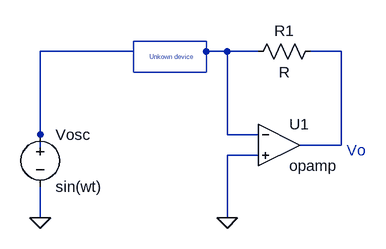
[diagram p0: schematic Draft1.asc]
Draft1.asc, the LTspice schematic file:
Version 4
SHEET 1 880 680
WIRE 336 208 192 208
WIRE 448 208 448 192
WIRE 480 208 448 208
WIRE 528 208 480 208
WIRE 656 208 608 208
WIRE 448 240 448 208
WIRE 192 336 192 208
WIRE 480 336 480 208
WIRE 528 336 480 336
WIRE 656 352 656 208
WIRE 656 352 592 352
WIRE 192 368 192 336
WIRE 528 368 480 368
WIRE 192 464 192 416
WIRE 480 464 480 368
FLAG 480 464 0
FLAG 192 464 0
SYMBOL voltage 192 320 R0
WINDOW 0 50 16 Center 2
SYMATTR InstName Vosc
SYMATTR Value sin(wt)
SYMBOL Opamps/opamp 560 288 R0
SYMATTR InstName U1
SYMBOL res 624 192 R90
WINDOW 0 0 56 VBottom 2
WINDOW 3 32 56 VTop 2
SYMATTR InstName R1
TEXT 360 216 Left 0 ;Unkown device
TEXT 664 360 Left 2 ;Vo
RECTANGLE Normal 336 192 448 240

The netlist it stands for:
* Draft1.asc
Vosc N001 0 sin(wt)
XU1 N002 0 N003 opamp Aol=100K GBW=10Meg  ; pins invin noninvin out
R1 N003 N002 R
* Unkown device
* Vo
.backanno
.end